# EAGLE design ATtinyRTCSwitch (EAGLE 7.2.0)
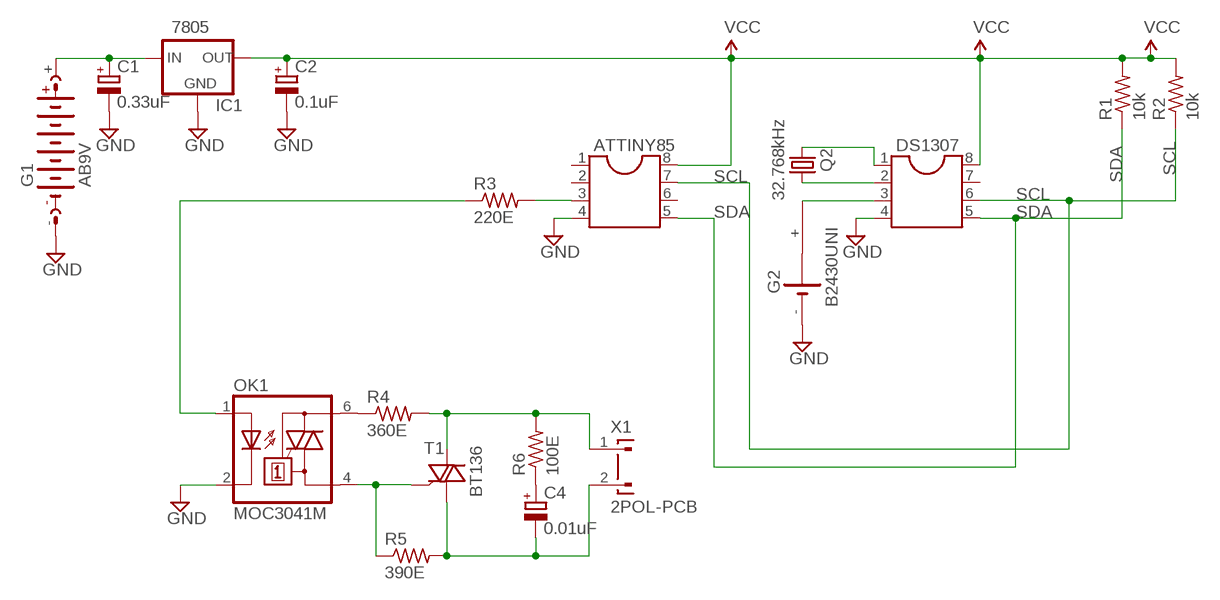
[diagram p0: schematic, sheet 1]

## Parts
ATTINY85  DIL8  [DIL08]
C1  0.33uF  CPOL-EUE2.5-5  [E2,5-5]
C2  0.1uF  CPOL-EUE2.5-5  [E2,5-5]
C4  0.01uF  CPOL-EUE2.5-5  [E2,5-5]
DS1307  DIL8  [DIL08]
G1  AB9V  [AB9V]
G2  B2430UNI  [B2430UNI]
IC1  7805  V_REG_78XXSIDE  [78XXL]
OK1  MOC3041M  [DIL06]
Q2  32.768kHz  CRYSTALTC26H  [TC26H]
R1  10k  R-US_0204/7  [0204/7]
R2  10k  R-US_0204/7  [0204/7]
R3  220E  R-US_0204/7  [0204/7]
R4  360E  R-US_0204/7  [0204/7]
R5  390E  R-US_0204/7  [0204/7]
R6  100E  R-US_0204/7  [0204/7]
T1  BT136  [TO220AB]
X1  2POL-PCB  [2POL-PCB]

## Nets
GND: ATTINY85.4 C1.- C2.- DS1307.4 G1.- G2.- IC1.GND OK1.2(C)
N$1: OK1.4(A1) R5.1 T1.3(G)
N$2: DS1307.1 Q2.2
N$3: DS1307.2 Q2.1
N$4: C1.+ G1.+ IC1.IN
N$5: DS1307.3 G2.+
N$6: C4.- R5.2 T1.1(A1) X1.2
N$7: R4.2 R6.2 T1.2(A2) X1.1
N$8: OK1.6(A2) R4.1
N$9: C4.+ R6.1
N$10: ATTINY85.3 R3.2
SCL: ATTINY85.7 DS1307.6 R2.1
SDA: ATTINY85.5 DS1307.5 R1.1
SWITCH_ON: OK1.1(A) R3.1
VCC: ATTINY85.8 C2.+ DS1307.8 IC1.OUT R1.2 R2.2
Unconnected: ATTINY85.1 ATTINY85.2 ATTINY85.6 DS1307.7 G2.+@1(+) G2.+@2(+) G2.+@3(+) G2.+@4(+) G2.-@1(-)

## Library data of the parts
ATTINY85 DS1307 = ic-package:DIL8: Dual In Line / Socket
C1 C2 C4 = rcl:CPOL-EU: POLARIZED CAPACITOR, European symbol
G1 = battery:AB9V: 9-V BATTERY CLIP
G2 = battery:B2430UNI: LI BATTERY
IC1 = SparkFun:V_REG_78XX: Voltage Regulator Standard 7805 5V regulator. IGO (Input Ground Output). Spark Fun Electronics SKU : COM-00107
OK1 = optocoupler:MOC30*: 6-Pin DIP Zero-Cross Optoisolators Triac Driver Output (250/400 Volt Peak) Source: Data sheet <http://www.fairchildsemi.com/ds/MO/MOC3031M.pdf> The old path of data sheet not more available 2013-05-06.; MF: FAIRCHILD SEMICONDUCTOR; MPN: MOC3041M; OC_FARNELL: 1086677; OC_NEWARK: 78K6090
Q2 = crystal:CRYSTAL: CRYSTAL; OC_FARNELL: unknown; OC_NEWARK: unknown
R1-R6 = rcl:R-US_: RESISTOR, American symbol
T1 = triac:BT136: Triac BT136 series E sensitive gate Source: http://www.nxp.com/acrobat_download/datasheets/BT136_SERIES_E_2.pdf
X1 = con-friwo:2POL-PCB: PCB SUPPLY CONNECTOR FRIWO (TEXAS); OC_FARNELL: unknown; OC_NEWARK: unknown

## Board
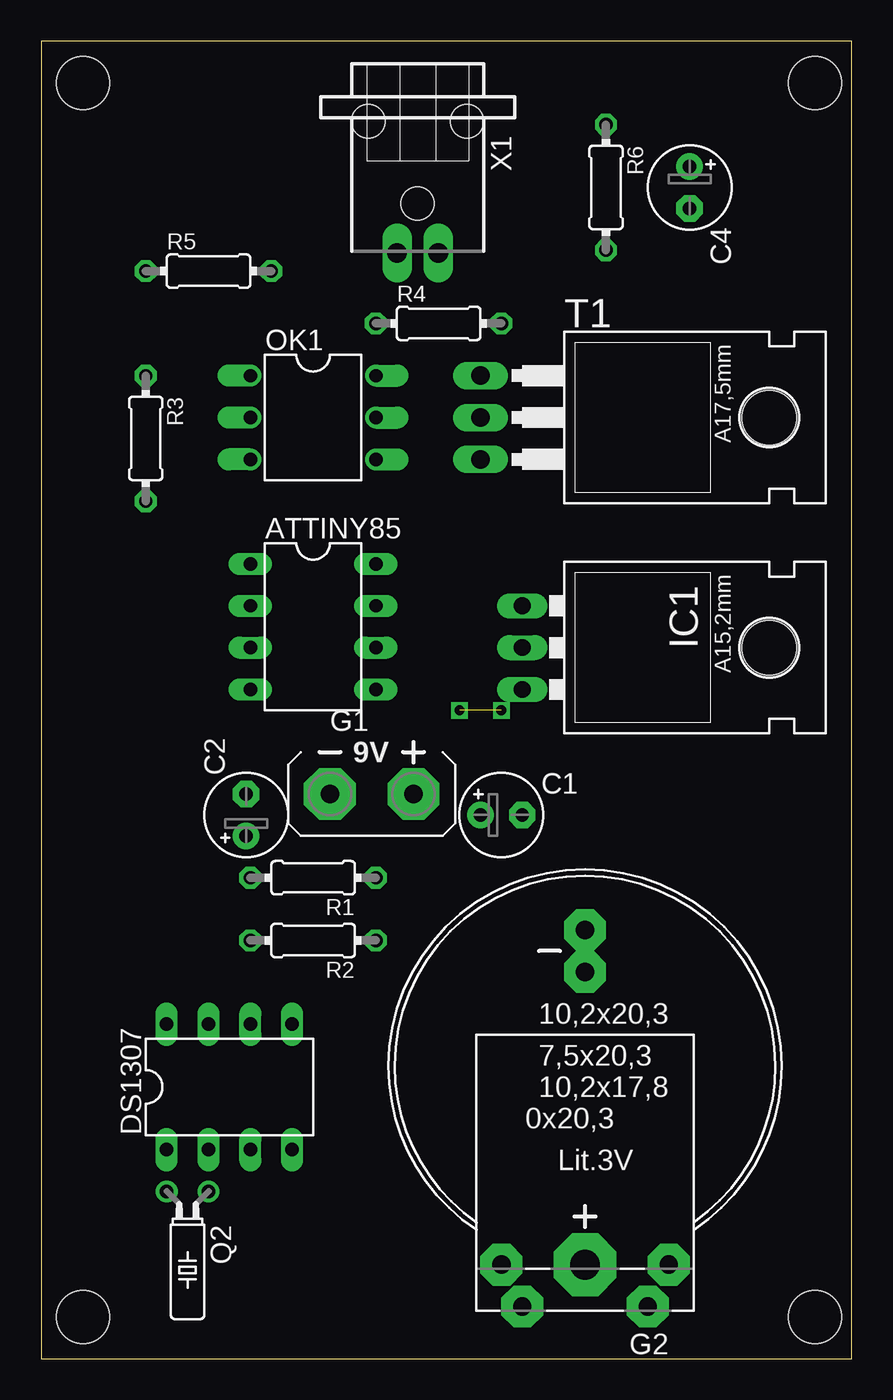
[diagram p1: board, top side]
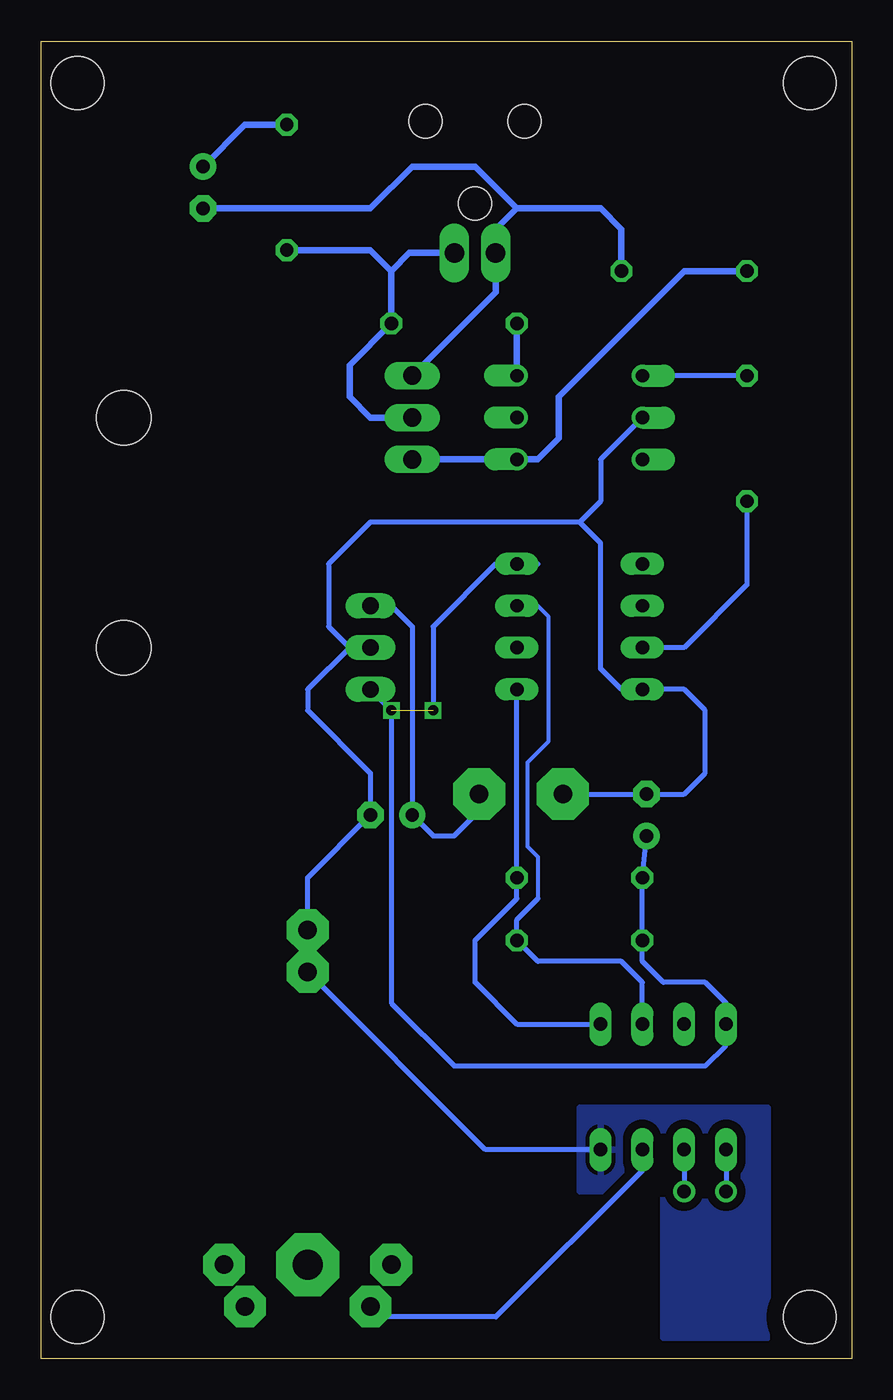
[diagram p2: board, bottom side, seen from below]

Size 49.2 x 80 mm. Coordinates in mm from the lower left corner, seen from the top.
Outline: 0,0 49.2,0 49.2,80 0,80 0,0
Copper layers (1*16): Top 0.035mm / dielectric 1.5mm / Bottom 0.035mm
Design rules "default": minimum track width 10mil, minimum drill 24mil, track to track 8mil, track to pad 8mil, pad to pad 8mil, via to via 8mil, smd to smd 8mil, copper to edge 40mil, drill to drill 8mil, minimum pad ring 10mil, minimum via ring 8mil, stop-mask expansion 4mil, vias tented up to drill 0mil, thermal gap 10mil
Holes 3.2 mm at 2.54,2.54 2.54,77.47 46.99,77.47 46.99,2.54

### Footprints (pad centres in the part's own frame; a part is rotated, then mirrored left to right if it is on the bottom)
DIL08 = drill 0.813 long: 1 -3.81,-3.81; 2 -1.27,-3.81; 3 1.27,-3.81; 4 3.81,-3.81; 5 3.81,3.81; 6 1.27,3.81; 7 -1.27,3.81; 8 -3.81,3.81
E2,5-5 = drill 0.813 pad 1.6: + -1.27,0 | drill 0.813 pad 1.6 octagon: - 1.27,0
AB9V = drill 1.118 pad 3.15 octagon: + 0,2.54; - 0,-2.54
B2430UNI = drill 1.118 pad 2.54 octagon: + 3.81,14.605; +@1 -3.81,14.605; +@2 -5.08,12.065; +@3 5.08,12.065; - 0,-5.715; -@1 0,-8.255 | drill 1.803 pad 3.81 octagon: +@4 0,12.065
78XXL = drill 1.016 long: GND 0,-3.81; IN -2.54,-3.81; OUT 2.54,-3.81 | hole 3.302: 0,11.176
DIL06 = drill 0.813 offset: 1 -2.54,-3.81; 2 0,-3.81; 3 2.54,-3.81; 4 2.54,3.81; 5 0,3.81; 6 -2.54,3.81
TC26H = drill 0.813: 1 -1.27,0; 2 1.27,0
0204/7 = drill 0.813 octagon: 1 -3.81,0; 2 3.81,0
TO220AB = drill 1.118 long: 1 -2.54,-6.35; 2 0,-6.35; 3 2.54,-6.35 | hole 3.302: 0,11.176
2POL-PCB = drill 1.2 long: 1 -1.25,11.6; 2 1.25,11.6 | hole 2: -3,3.6; 3,3.6; 0,8.6

### Placement (x,y rotation side)
ATTINY85  16.51,44.45 270 top
C1  27.94,33.02 0 top
C2  12.45,33.02 90 top
C4  39.37,71.12 270 top
DS1307  11.43,16.51 0 top
G1  20.07,34.29 270 top
G2  33.02,17.78 180 top
IC1  33.02,43.18 270 top
OK1  16.51,57.15 270 top
Q2  8.89,10.16 180 top
R1  16.51,29.21 180 top
R2  16.51,25.4 180 top
R3  6.35,55.88 270 top
R4  24.13,62.87 0 top
R5  10.16,66.04 0 top
R6  34.29,71.12 270 top
T1  33.02,57.15 270 top
X1  22.86,78.74 180 top

### Tracks (layer width: path | path; a pad name or v marks a point on that pad's centre or on a via)
GND
  Bottom 0.305: DS1307.4 22.23,12.7 G2.- 33.02,29.21 C1.- 29.21,35.56 33.02,39.37 33.02,40.64 30.48,43.18 | IC1.GND 30.48,43.18 | G1.- C2.- 10.16,34.29 8.89,35.56 8.89,39.37 10.16,40.64 ATTINY85.4 13.97,40.64 15.24,41.91 15.24,49.53 16.51,50.8 | 16.51,50.8 29.21,50.8 31.75,48.26 31.75,44.45 30.48,43.18 | OK1.2 15.24,54.61 15.24,52.07 16.51,50.8
  pour Bottom (isolate 0.508): 5.08,15.24 16.51,15.24 16.51,10.16 11.43,10.16 11.43,1.27 5.08,1.27
N$1
  Bottom 0.406: R5.1 10.16,66.04 17.78,58.42 17.78,55.88 19.05,54.61 OK1.4 T1.3
N$2
  Bottom 0.305: DS1307.1 Q2.2
N$3
  Bottom 0.305: DS1307.2 Q2.1
N$4
  Bottom 0.305: IC1.IN 27.94,45.72 26.67,44.45 C1.+ 25.4,31.75 24.13,31.75 22.86,33.02 G1.+
N$5
  Bottom 0.305: DS1307.3 12.7,11.43 21.59,2.54 28.57,2.54 G2.+
N$6
  Bottom 0.406: T1.1 21.61,64.75 X1.2 21.59,67.16 21.59,68.58 20.32,69.85 | R5.2 13.97,68.58 15.24,69.85 20.32,69.85 | C4.- 29.21,69.85 26.67,72.39 22.86,72.39 20.32,69.85
N$7
  Bottom 0.406: 27.94,66.04 R4.2 30.48,60.33 30.48,58.42 29.21,57.15 T1.2 | 27.94,66.04 29.21,67.31 R6.2 | X1.1 26.84,67.14 27.94,66.04
N$8
  Bottom 0.406: R4.1 OK1.6
N$9
  Bottom 0.406: R6.1 36.83,74.93 C4.+
N$10
  Bottom 0.305: R3.2 6.35,46.99 10.16,43.18 ATTINY85.3
N$12  (via drill 0.6)
  other vias: 25.4,39.37
N$13  (via drill 0.6)
  other vias: 27.94,39.37
SCL
  Bottom 0.254: ATTINY85.7 19.05,45.72 18.41,45.09 18.41,37.47 19.68,36.2 19.68,31.11 19.05,30.48 19.05,27.94
  Bottom 0.305: DS1307.6 12.7,22.86 13.97,24.13 19.05,24.13 R2.1 20.32,26.67 19.05,27.94
SDA
  Bottom 0.305: DS1307.5 20.32,20.32 22.86,22.86 22.86,25.4 20.32,27.94 R1.1 ATTINY85.5
SWITCH_ON
  Bottom 0.305: R3.1 OK1.1
VCC  (1 unrouted)
  Bottom 0.305: C2.+ R1.2 R2.2 12.7,24.13 11.43,22.86 8.89,22.86 7.62,21.59 DS1307.8 7.62,19.05 8.89,17.78 24.13,17.78 27.94,21.59 27.94,39.37 IC1.OUT | 19.05,48.26 ATTINY85.8 21.59,48.26 25.4,44.45 25.4,39.37